# Altium schematic sheet Nuio_Left_Keyboard_Rev_H_UI.SchDoc: Nuio - Left Keyboard UI
size B; Organization: OLogic, Inc.; SheetNumber: 4; SheetTotal: 5; PageSetup: Record=PageOptions|CenterHorizontal=True|CenterVertical=True|PrintScale=0.95|XCorrection=1.00|YCorrection=1.00|PrintKind=1|BorderSize=5000000|LeftOffset=0|BottomOffset=0|Orientation=2|PaperLength=1000|PaperWidth=1000|Scale=100|PaperSource=7|PrintQuality=-4|MediaType=1|DitherType=10|PaperKind=Letter|PrintScaleMode=1
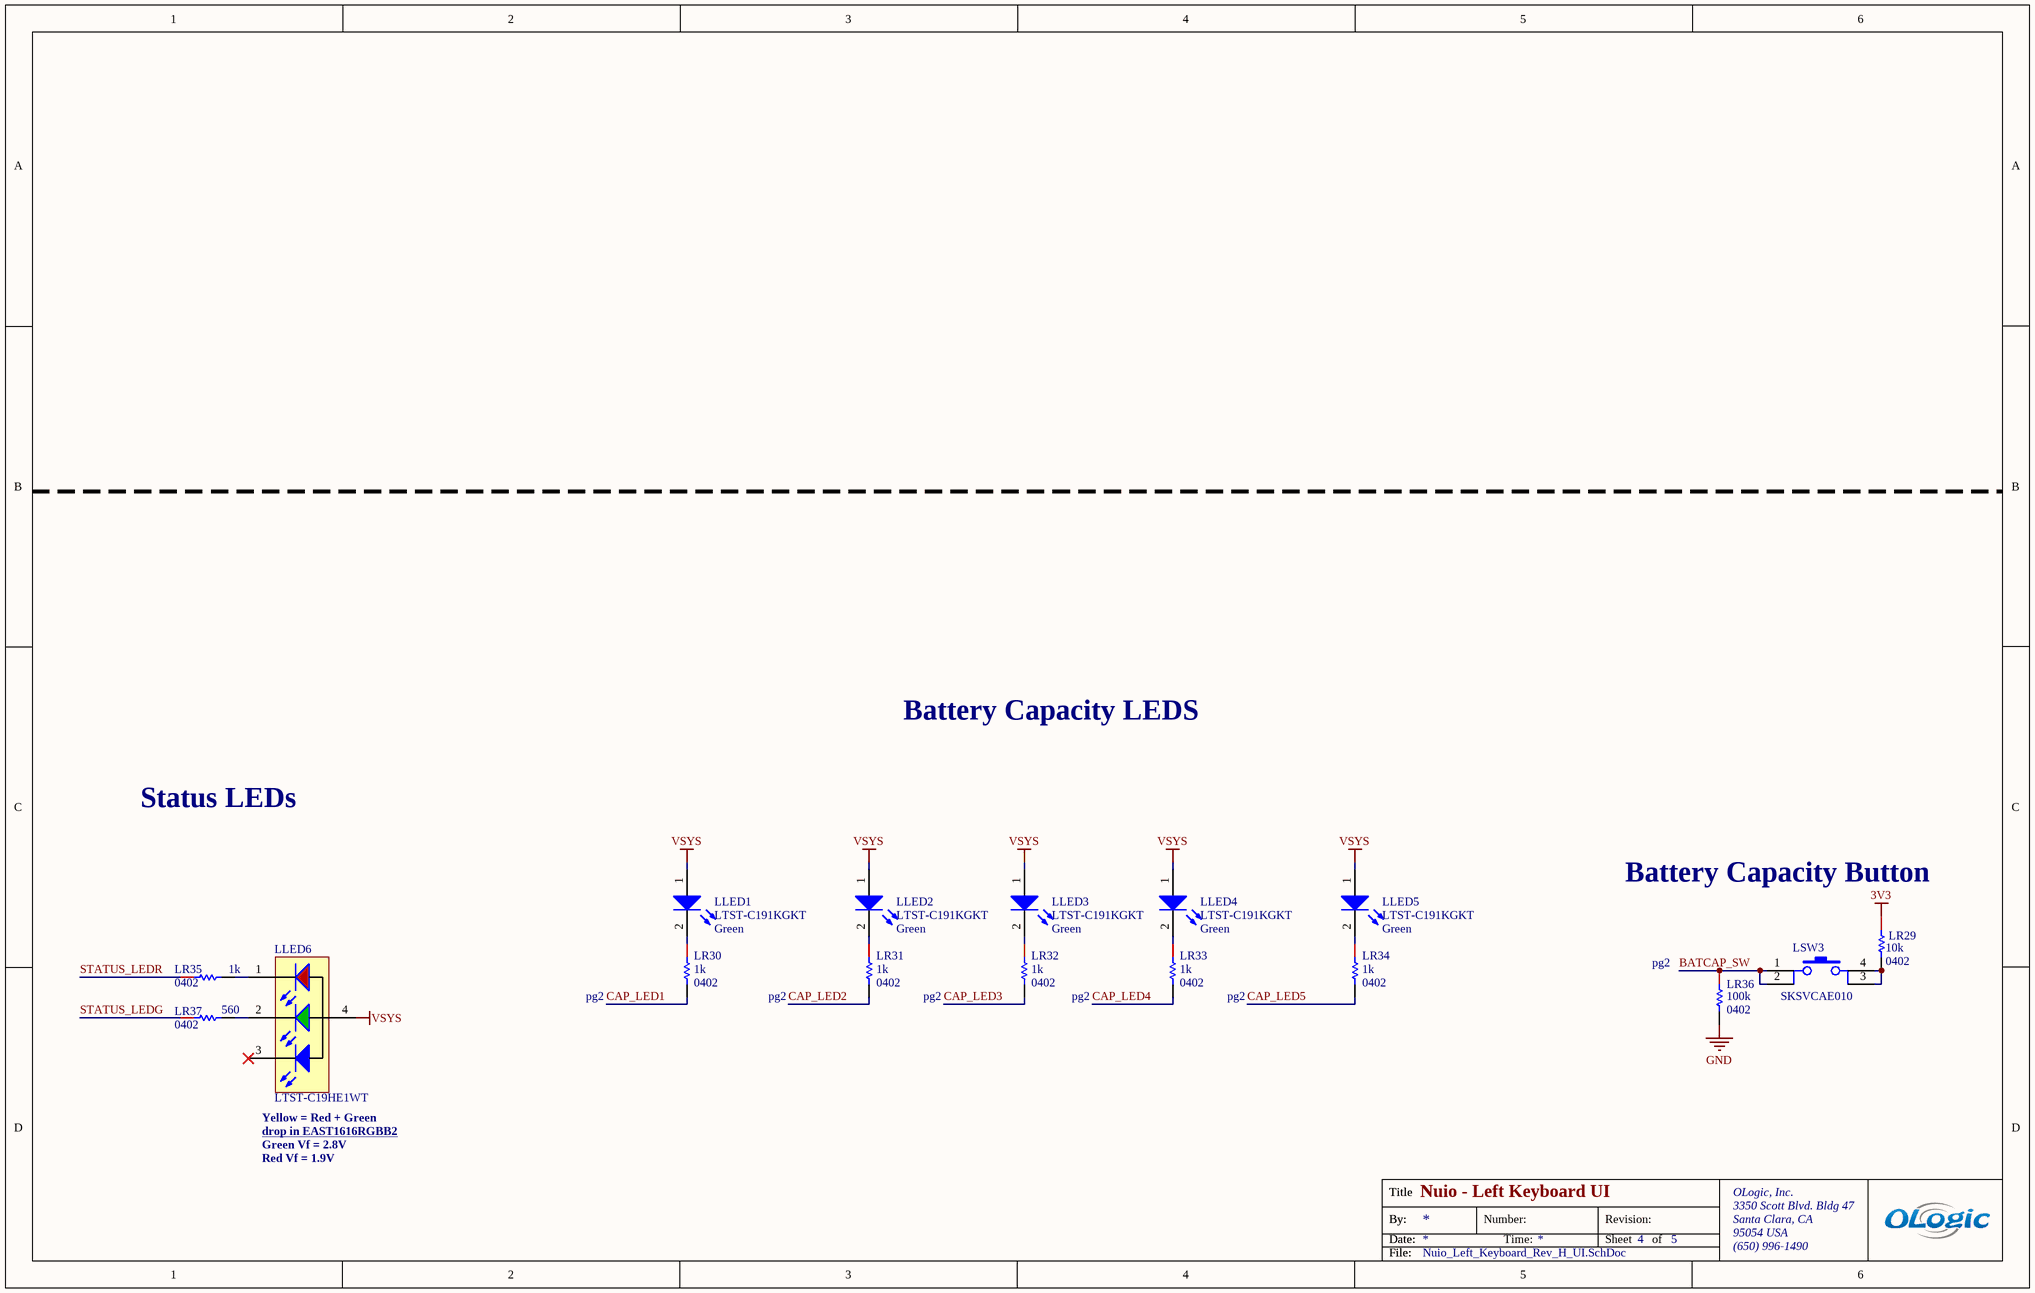
[diagram p0: Nuio_Left_Keyboard_Rev_H_UI.SchDoc]

## Parts
LLED1  Color: Green  [SM-LED-0603]  (hidden comment: LTST-C191KGKT)
LLED2  Color: Green  [SM-LED-0603]  (hidden comment: LTST-C191KGKT)
LLED3  Color: Green  [SM-LED-0603]  (hidden comment: LTST-C191KGKT)
LLED4  Color: Green  [SM-LED-0603]  (hidden comment: LTST-C191KGKT)
LLED5  Color: Green  [SM-LED-0603]  (hidden comment: LTST-C191KGKT)
LLED6  LTST-C19HE1WT  [LTST-C19HE1WT]
LR29  Resistance: 10k  Package (Imperial): 0402  [RESC0402_YAGEO]  (hidden comment: RES SMD 10K OHM 1% 1/16W 0402)
LR30  Resistance: 1k  Package (Imperial): 0402  [RESC0402(1005)_L]  (hidden comment: RES SMD 1K OHM 1% 1/16W 0402)
LR31  Resistance: 1k  Package (Imperial): 0402  [RESC0402(1005)_L]  (hidden comment: RES SMD 1K OHM 1% 1/16W 0402)
LR32  Resistance: 1k  Package (Imperial): 0402  [RESC0402(1005)_L]  (hidden comment: RES SMD 1K OHM 1% 1/16W 0402)
LR33  Resistance: 1k  Package (Imperial): 0402  [RESC0402(1005)_L]  (hidden comment: RES SMD 1K OHM 1% 1/16W 0402)
LR34  Resistance: 1k  Package (Imperial): 0402  [RESC0402(1005)_L]  (hidden comment: RES SMD 1K OHM 1% 1/16W 0402)
LR35  Resistance: 1k  Package (Imperial): 0402  [RESC0402(1005)_L]  (hidden comment: RES SMD 1K OHM 1% 1/16W 0402)
LR36  value 100k  Case Code (Imperial): 0402  [RESC0402(1005)_L]  (hidden comment: RES 100K OHM 1% 1/16W 0402)
LR37  Package (Imperial): 0402  [RESC0402(1005)_L]  (hidden comment: 560)
LSW3  SKSVCAE010  [SKSVCAE010]

## Nets
3V3: LR29.1
GND: LR36.2
VSYS: LLED1.1(A) LLED2.1(A) LLED3.1(A) LLED4.1(A) LLED5.1(A) LLED6.4(Anode)
BATCAP_SW: LR36.1 LSW3.1 LSW3.2
CAP_LED1: LR30.2
CAP_LED2: LR31.2
CAP_LED3: LR32.2
CAP_LED4: LR33.2
CAP_LED5: LR34.2
STATUS_LEDG: LR37.1
STATUS_LEDR: LR35.1
NetLLED1_2: LLED1.2(K) LR30.1
NetLLED2_2: LLED2.2(K) LR31.1
NetLLED3_2: LLED3.2(K) LR32.1
NetLLED4_2: LLED4.2(K) LR33.1
NetLLED5_2: LLED5.2(K) LR34.1
NetLLED6_1: LLED6.1(R) LR35.2
NetLLED6_2: LLED6.2(G) LR37.2
NetLR29_2: LR29.2 LSW3.3 LSW3.4

Not connected (* = marked no-connect by the designer): LLED6 3(B)*

## Notes on the sheet
- Battery Capacity LEDS
- Status LEDs
- (near LR29) Battery Capacity Button
- (near LR36) pg2
- pg2
- (near LR32) pg2
- drop in EAST1616RGBB2 <https://www.digikey.com/en/products/detail/everlight-electronics-co-ltd/EAST1616RGBB2/8510360?s=N4IgTCBcDaIKIEEDKAVAjANkwJQOICF8IBdAXyA>
- Yellow = Red + Green
- Green Vf = 2.8V
- Red Vf = 1.9V
- Title
- By:
- Date:
- Number:
- Time:
- Revision:
- Sheet
- of
- OLogic, Inc.
- 3350 Scott Blvd. Bldg 47
- Santa Clara, CA
- 95054 USA
- File:
- (650) 996-1490

## Library data of the parts
LLED1-LLED5 = CMP-001-0086-08: LED GREEN CLEAR THIN 0603 SMD; Manufacturer: Lite-On Inc; Lens Style/Size: Rectangle with Flat Top, 1.1mm x 0.8mm; Voltage - Forward (Vf) (Typ): 2V; Millicandela Rating: 35mcd; Viewing Angle: 130°; Wavelength - Dominant: 571nm; Wavelength - Peak: 574nm; Current - Test: 20mA; Manufacturer Part Number: LTST-C191KGKT; Pin Count: 2; Packaging: Cut Tape (CT); Size / Dimension: 1.60mm L x 0.80mm W; Package / Case: 0603 (1608 Metric); ClassName: *; Mounting Type: Surface Mount; Lens Type: Clear; RoHS: RoHS Compliant; Height: 0.55mm; Pricing 1: 1=0.3, 10=0.238, 100=0.1296, 250=0.0864, 500=0.07344, 1000=0.05616, 2500=0.05076 (USD); Stock 1: 84829
LLED6 = CMP-001-0089-03: LED RGB 605/525/470NM DIFF SMD; Manufacturer: Lite-On Inc.; Voltage - Forward (Vf) (Typ): 2.1V Red, 3.35V Green, 3.35V Blue; Lens Style/Size: Rectangle with Flat Top, 1.15mm x 1.60mm; Lens Color: White; Current - Test: 20mA Red, 20mA Green, 20mA Blue; Millicandela Rating: 112.5mcd Red, 281mcd Green, 104mcd Blue; Lens Transparency: Diffused; Wavelength - Dominant: 624nm Red, 525nm Green, 470nm Blue; Wavelength - Peak: 632nm Red, 520nm Green, 468nm Blue; Viewing Angle: 130°; Pin Count: 4; Stock 1: 369310; Mounting Type: Surface Mount; Size / Dimension: 1.60mm L x 1.60mm W; ComponentLink1URL: http://optoelectronics.liteon.com/upload/download/DS22-2008-0044/S_110_LTST-C19HE1WT.pdf; Manufacturer Part Number: LTST-C19HE1WT; RoHS: RoHS Compliant; Part Status: Active; ComponentLink1Description: http://optoelectronics.liteon.com/upload/download/DS22-2008-0044/S_110_LTST-C19HE1WT.pdf; Package / Case: 0606 (1616 Metric); Pricing 1: 1=0.59, 10=0.424, 25=0.3464, 100=0.277, 250=0.23372, 500=0.19912, 1000=0.15583 (USD); Height (Max): 0.35mm; Supplier Device Package: *; Color: Red, Green, Blue (RGB); Features: -; Packaging: Cut Tape (CT); Component Name: LTST-C19HE1WT
LR29 = CMP-001-1262-04: 10 kOhms ±1% 0.063W, 1/16W Chip Resistor 0402 (1005 Metric) Anti-Sulfur, Automotive AEC-Q200, Moisture Resistant Thin Film; Manufacturer: Yageo; Manufacturer Part Number: AT0402FRE0710KL; Max Power Dissipation: 63mW; Temperature Coefficient: 50ppm/°C; Width: 0.02inch; Case Code (Metric): 1005; Height: 0.014inch; Min Operating Temperature: -55°C; Supplier: Digi-Key; Tolerance: 1%; Features: Moisture Resistant,Automotive AEC-Q200,Anti-Sulfur; Length: 0.039inch; Number of Terminations: 2; Case/Package: 0402; Packaging: Tape and Reel; Composition: Thin Film; Supplier Part Number: YAG2104CT-ND; Max Operating Temperature: 155°C
LR30-LR35 = CMP-007-0405-16: 1k ±1% 0.063W, 1/16W Chip Resistor 0402 (1005 Metric) Moisture Resistant Thick FilmRES 1K OHM 1% 1/16W 0402; Manufacturer: Yageo; Manufacturer Part Number: RC0402FR-071KL; Power: 63mW; Package (Metric): 1005; Temperature Coefficient: 100ppm/°C; Supplier Part Number: 311-1.00KLRCT-ND; Supplier: Digi-Key; Height: 400µm; Termination: SMD/SMT; Composition: Thick Film; Width: 500µm; Tolerance: 1%
LR36 = CMP-007-0354-15: ±1% 0.063W, 1/16W Chip Resistor 0402 (1005 Metric) Moisture Resistant Thick Film; Manufacturer: YAGEO; Manufacturer Part Number: RC0402FR-07100KL; Max Power Dissipation: 63mW; Temperature Coefficient: 100ppm/°C; Voltage Rating: 50V; Case/Package: 0402; Construction: Rectangular; Depth: 0.5mm; Features: Moisture Resistant; Height: 0.016inch; Lead Free: Lead Free; Length: 0.039inch; Max Operating Temperature: 155°C; Military Standard: Not; Min Operating Temperature: -55°C; Power Rating: 63mW; Reach SVHC Compliant: No; Resistance Tolerance: 1%; Resistor Type: Thick Film; RoHS Compliant: Yes; Series: RC; Termination: SMD/SMT; Tolerance: 1%; Width: 0.02inch
LR37 = CMP-00080-14: RES SMD 560 OHM 1% 1/16W 0402; Power: 63mW; Package (Metric): 1005; Temperature Coefficient: 100ppm/°C; Resistance: 560; Height: 400µm; Length: 1mm; Tolerance: 1%; Termination: SMD/SMT
LSW3 = CMP-00343-02: 2.8x1.9mm Compact Type with Projection Surface Mount SKSV Series Tact Switch; Manufacturer: Alps Alpine; Voltage Rating (DC): 12 VDC; Current Rating: 50 mA; Manufacturer Part Number: SKSVCAE010; RoHS Compliant: Yes